# EAGLE schematic HTVC_NOPWM (EAGLE 7.4.0)
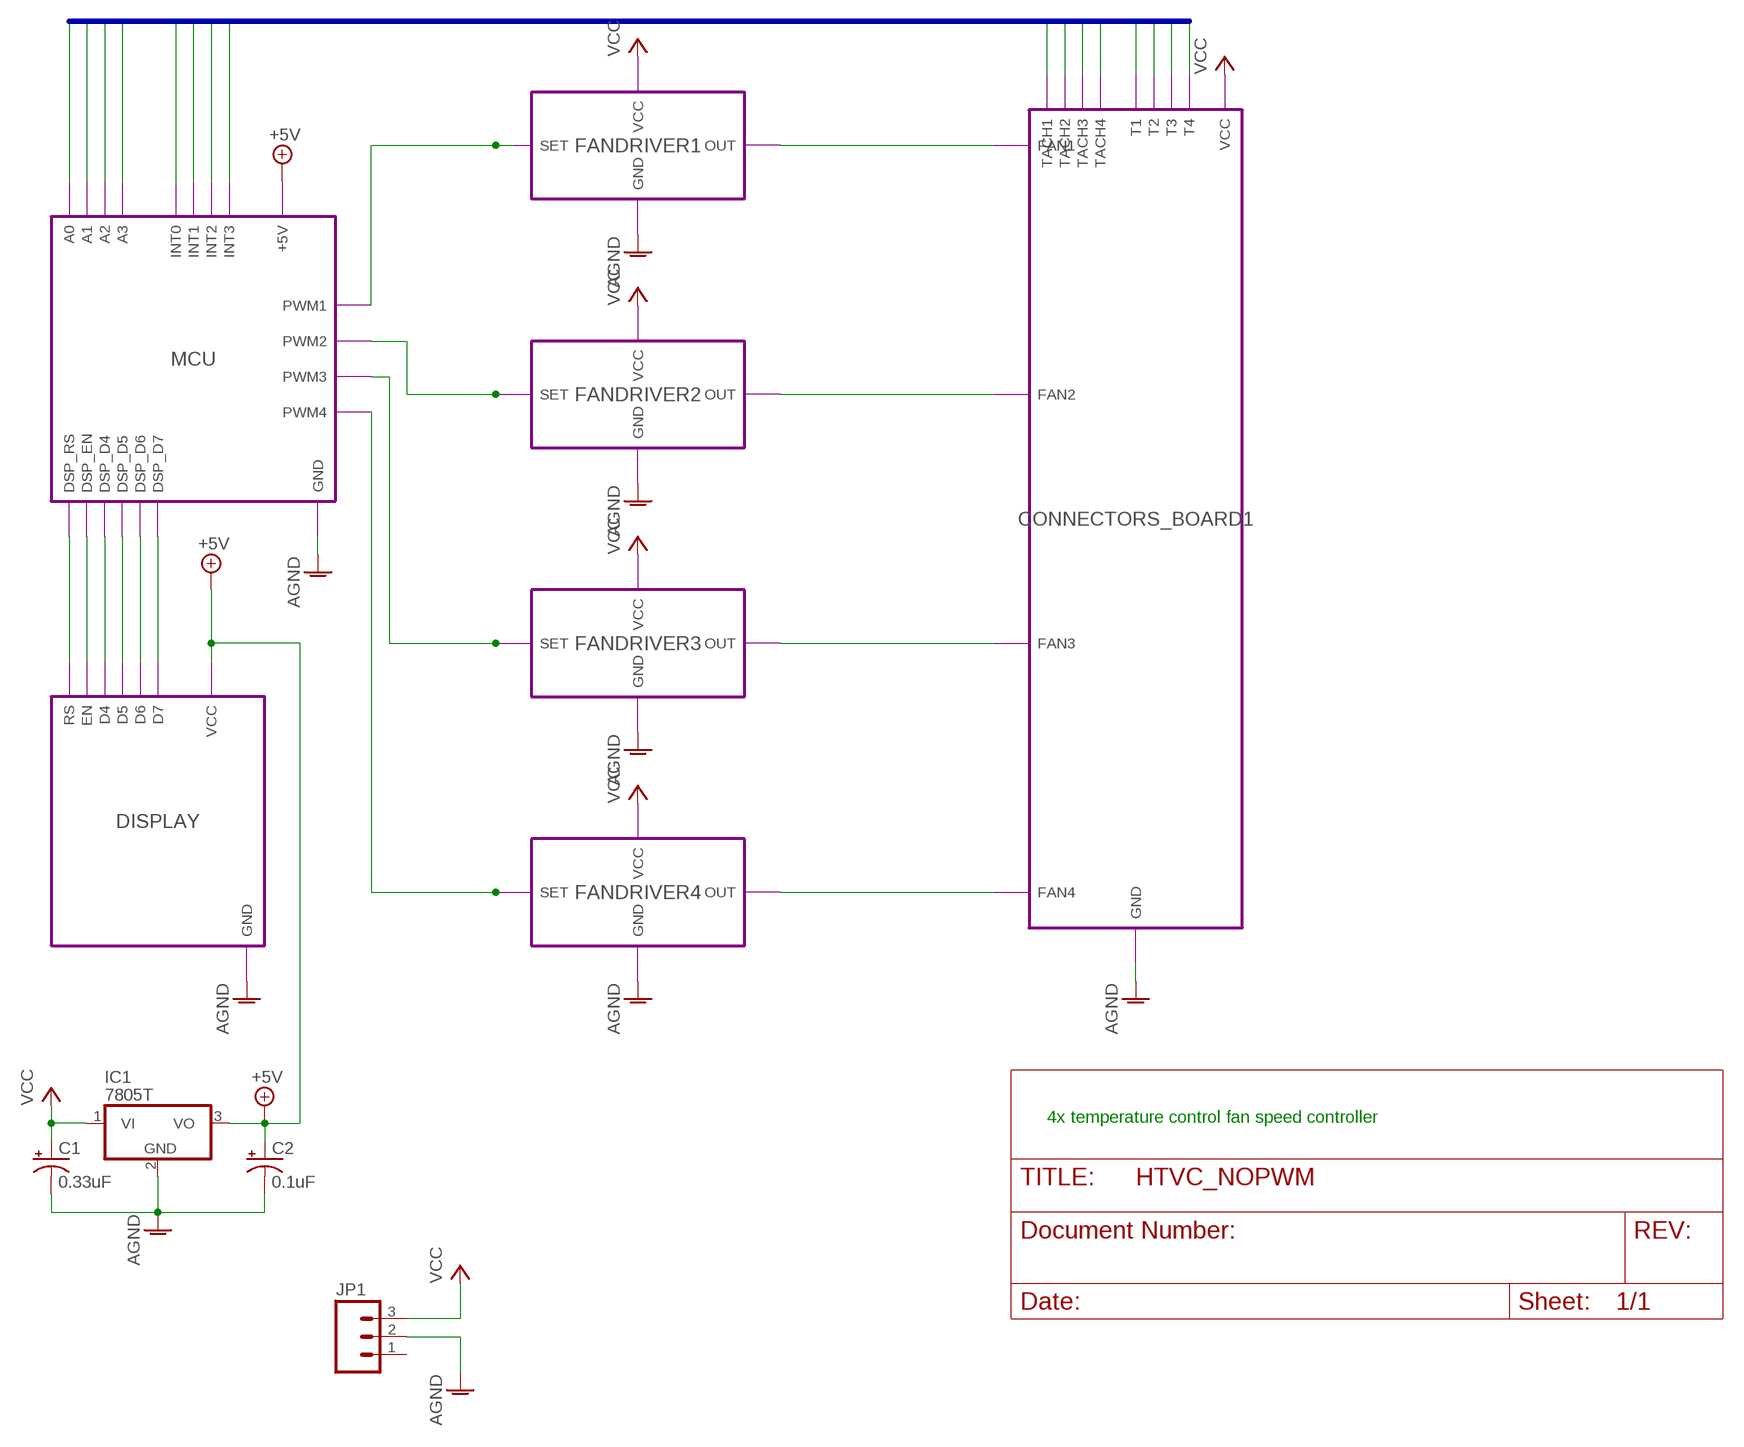
[diagram p0: schematic, sheet 1]

## Parts
C1  0.33uF  CPOL-USE2.5-6  [E2,5-6]
C2  0.1uF  CPOL-USE2.5-6  [E2,5-6]
IC1  7805T  [TO220H]
JP1  M03POLAR  [MOLEX-1X3]

## Module instances
MCU = MCU
CONNECTORS_BOARD1 = CONNECTORS_BOARD
DISPLAY = DISPLAY_BOARD
FANDRIVER1 = FANDRIVER
FANDRIVER2 = FANDRIVER
FANDRIVER3 = FANDRIVER
FANDRIVER4 = FANDRIVER

## Nets
+5V [+5V]: C2.+ IC1.3(VO) ; port DISPLAY.VCC MCU.+5V
A0: port MCU.A0 CONNECTORS_BOARD1.T1
A1: port MCU.A1 CONNECTORS_BOARD1.T2
A2: port MCU.A2 CONNECTORS_BOARD1.T3
A3: port MCU.A3 CONNECTORS_BOARD1.T4
AGND [AGND]: C1.- C2.- IC1.2(GND) JP1.2 ; port FANDRIVER1.GND FANDRIVER2.GND FANDRIVER3.GND FANDRIVER4.GND DISPLAY.GND MCU.GND CONNECTORS_BOARD1.GND
N$1: port MCU.DSP_RS DISPLAY.RS
N$2: port MCU.DSP_EN DISPLAY.EN
N$3: port MCU.DSP_D4 DISPLAY.D4
N$4: port MCU.DSP_D5 DISPLAY.D5
N$5: port MCU.DSP_D6 DISPLAY.D6
N$6: port MCU.DSP_D7 DISPLAY.D7
N$9: port FANDRIVER4.OUT CONNECTORS_BOARD1.FAN4
N$10: port FANDRIVER3.OUT CONNECTORS_BOARD1.FAN3
N$11: port FANDRIVER2.OUT CONNECTORS_BOARD1.FAN2
N$12: port FANDRIVER1.OUT CONNECTORS_BOARD1.FAN1
N$21: port MCU.PWM1 FANDRIVER1.SET
N$22: port MCU.PWM2 FANDRIVER2.SET
N$23: port MCU.PWM3 FANDRIVER3.SET
N$37: port MCU.PWM4 FANDRIVER4.SET
TACH0: port MCU.INT0 CONNECTORS_BOARD1.TACH1
TACH1: port MCU.INT1 CONNECTORS_BOARD1.TACH2
TACH2: port MCU.INT2 CONNECTORS_BOARD1.TACH3
TACH3: port MCU.INT3 CONNECTORS_BOARD1.TACH4
VCC [VCC]: C1.+ IC1.1(VI) JP1.3 ; port FANDRIVER1.VCC FANDRIVER2.VCC FANDRIVER3.VCC FANDRIVER4.VCC CONNECTORS_BOARD1.VCC
Unconnected: JP1.1

## Buses
A[0..3],TACH[0..3]

## Notes on the sheet
- 4x temperature control fan speed controller

## Library data of the parts
C1 C2 = rcl:CPOL-US: POLARIZED CAPACITOR, American symbol
IC1 = linear:78*: Positive VOLTAGE REGULATOR Source: http://cache.national.com/ds/LM/LM78L05.pdf http://www.fairchildsemi.com/ds/LM/LM7805.pdf
JP1 = SparkFun-Connectors:M03: Header 3 Standard 3-pin 0.1" header. Use with straight break away headers (SKU : PRT-00116), right angle break away headers (PRT-00553), swiss pins (PRT-00743), machine pins (PRT-00117), and female headers (PRT-00115). Molex polarized connector foot print use with SKU : PRT-08232 with associated crimp pins and housings.

## Module DISPLAY_BOARD
Ports: VCC(pwr) GND(pwr) RS(io) EN(io) D4(io) D5(io) D6(io) D7(io)
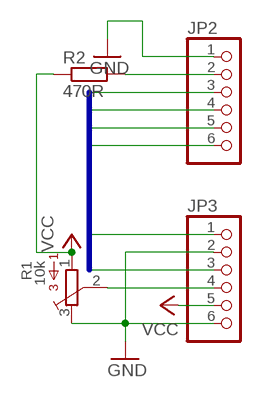
[diagram p1: schematic, module DISPLAY_BOARD, sheet 1]

### Parts
JP2  PINHD-1X6  [1X06]
JP3  PINHD-1X6  [1X06]
R1  10k  3362P  [3362P]
R2  470R  R-EU_0204/7  [0204/7]

### Nets
D4: JP2.6
D5: JP2.5
D6: JP2.4
D7: JP2.3
EN: JP3.1
GND: JP2.1 JP3.2 JP3.6 R1.3
N$1: JP3.4 R1.2
N$2: JP2.2 R2.2
RS: JP3.3
VCC: JP3.5 R1.1 R2.1

### Buses
D[4..7],BACKLIGHT,RS,EN

### Library data of the parts
JP2 JP3 = pinhead:PINHD-1X6: PIN HEADER
R1 = nervus:3362: 3362 Series 1/4" Square Trimmer
R2 = rcl:R-EU_: RESISTOR, European symbol

## Module CONNECTORS_BOARD
Ports: FAN1(io) FAN2(io) FAN3(io) FAN4(io) GND(io) TACH1(io) TACH2(io) TACH3(io) TACH4(io) T1(io) T2(io) T3(io) T4(io) VCC(pwr)
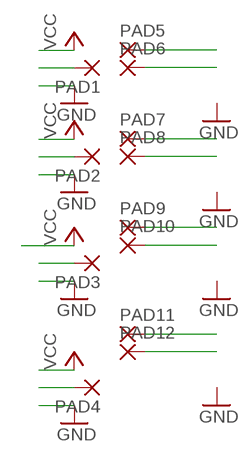
[diagram p2: schematic, module CONNECTORS_BOARD, sheet 1]

### Parts
PAD1  2,15/1,0  [2,15/1,0]
PAD2  2,15/1,0  [2,15/1,0]
PAD3  2,15/1,0  [2,15/1,0]
PAD4  2,15/1,0  [2,15/1,0]
PAD5  2,15/1,0  [2,15/1,0]
PAD6  2,15/1,0  [2,15/1,0]
PAD7  2,15/1,0  [2,15/1,0]
PAD8  2,15/1,0  [2,15/1,0]
PAD9  2,15/1,0  [2,15/1,0]
PAD10  2,15/1,0  [2,15/1,0]
PAD11  2,15/1,0  [2,15/1,0]
PAD12  2,15/1,0  [2,15/1,0]

### Nets
FAN1 [VCC]: PAD6.1(P)
FAN2 [VCC]: PAD8.1(P)
FAN3 [VCC]: PAD10.1(P)
FAN4 [VCC]: PAD12.1(P)
T1: PAD1.1(P)
T2: PAD2.1(P)
T3: PAD3.1(P)
T4: PAD4.1(P)
TACH1: PAD5.1(P)
TACH2: PAD7.1(P)
TACH3: PAD9.1(P)
TACH4: PAD11.1(P)

### Library data of the parts
PAD1-PAD12 = wirepad:2,15/1,0: THROUGH-HOLE PAD

## Module MCU
Ports: PWM1(out) PWM2(out) PWM3(out) PWM4(out) DSP_RS(io) DSP_EN(io) DSP_D4(io) DSP_D5(io) DSP_D6(io) DSP_D7(io) GND(pwr) A0(io) A1(io) A2(io) A3(io) INT0(io) INT1(io) INT2(io) INT3(io) +5V(io)
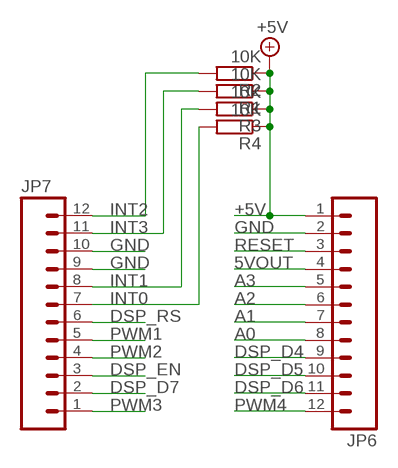
[diagram p3: schematic, module MCU, sheet 1]

### Parts
JP6  M12PTH  [1X12]
JP7  M12PTH  [1X12]
R1  10K  R-EU_R0805  [R0805]
R2  10K  R-EU_R0805  [R0805]
R3  10K  R-EU_R0805  [R0805]
R4  10K  R-EU_R0805  [R0805]

### Nets
5VOUT: JP6.4
+5V [VCC]: JP6.1 R1.1 R2.1 R3.1 R4.1
A0: JP6.8
A1: JP6.7
A2: JP6.6
A3: JP6.5
DSP_D4: JP6.9
DSP_D5: JP6.10
DSP_D6: JP6.11
DSP_D7: JP7.2
DSP_EN: JP7.3
DSP_RS: JP7.6
GND: JP6.2 JP7.9 JP7.10
INT0: JP7.7 R4.2
INT1: JP7.8 R3.2
INT2: JP7.12 R2.2
INT3: JP7.11 R1.2
PWM1: JP7.5
PWM2: JP7.4
PWM3: JP7.1
PWM4: JP6.12
RESET: JP6.3

### Library data of the parts
JP6 JP7 = SparkFun:M12: Header 12 Standard 12-pin 0.1" header. Use with straight break away headers (SKU : PRT-00116), right angle break away headers (PRT-00553), swiss pins (PRT-00743), machine pins (PRT-00117), and female headers (PRT-00115).
R1-R4 = rcl:R-EU_: RESISTOR, European symbol

## Module FANDRIVER
Ports: SET(in) OUT(out) VCC(pwr) GND(pwr)
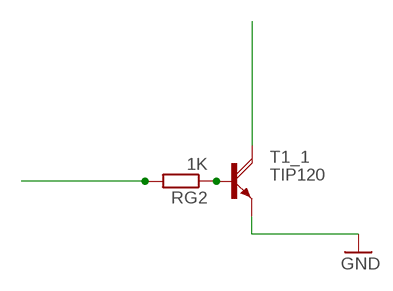
[diagram p4: schematic, module FANDRIVER, sheet 1]

### Parts
RG2  1K  R-EU_R0805  [R0805]
T1_1  TIP120  [TO220AH]

### Nets
GND: T1_1.E
N$10: RG2.1 T1_1.B
OUT: T1_1.C
SET: RG2.2

### Library data of the parts
RG2 = rcl:R-EU_: RESISTOR, European symbol
T1_1 = transistor-power:TIP120: NPN DARLINGTON TRANSISTOR